# EAGLE design dil_oscillator (EAGLE 7.6.0)
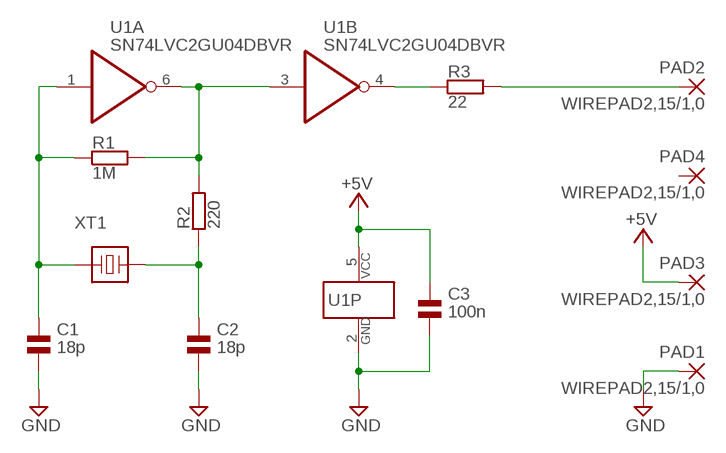
[diagram p0: schematic, sheet 1]

## Parts
C1  18p  CAP_NPOL-0603  [0603]
C2  18p  CAP_NPOL-0603  [0603]
C3  100n  CAP_NPOL-0603  [0603]
PAD1  WIREPAD2,15/1,0  [2,15/1,0]
PAD2  WIREPAD2,15/1,0  [2,15/1,0]
PAD3  WIREPAD2,15/1,0  [2,15/1,0]
PAD4  WIREPAD2,15/1,0  [2,15/1,0]
R1  1M  RES-SMD_0603  [0603]
R2  220  RES-SMD_0603  [0603]
R3  22  RES-SMD_0603  [0603]
U1  SN74LVC2GU04DBVR  74HC2GU04GV  [SOT457]
XT1  XTAL_3225  [3225_4PAD]

## Nets
+5V: C3.1 PAD3.1(P) U1.5(P:VCC)
GND: C1.2 C2.2 C3.2 PAD1.1(P) U1.2(P:GND)
N$1: C1.1 R1.1 U1.1(A:I) XT1.1
N$2: R1.2 R2.2 U1.3(B:I) U1.6(A:O)
N$3: C2.1 R2.1 XT1.3
N$4: R3.1 U1.4(B:O)
OUT: PAD2.1(P) R3.2
Unconnected: PAD4.1(P)

## Library data of the parts
C1-C3 = jc-passive:CAP_NPOL
PAD1-PAD4 = wirepad:WIREPAD: Wire PAD connect wire on PCB
R1-R3 = jc-passive:RES
U1 = jc-logic:74*2GU04: Dual unbuffered inverter
XT1 = jc-oscillators:XTAL_*

## Board
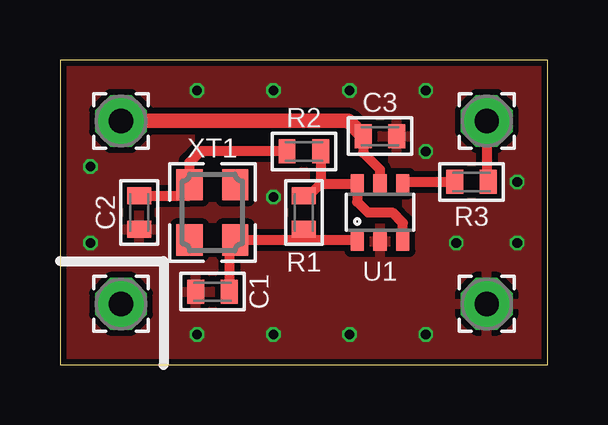
[diagram p1: board, top side]
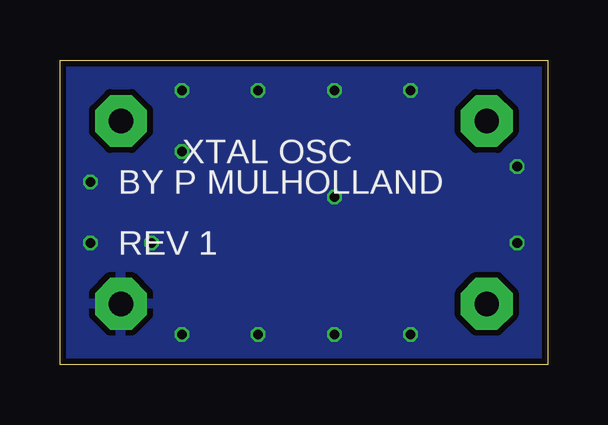
[diagram p2: board, bottom side, seen from below]

Size 20.32 x 12.7 mm. Coordinates in mm from the lower left corner, seen from the top.
Outline: 0,0 20.32,0 20.32,12.7 0,12.7 0,0
Copper layers (1*16): Top 0.035mm / dielectric 0.2mm / Bottom 0.035mm
Design rules "jlcpcb-2layers": minimum track width 3.5mil, minimum drill 0.2mm, track to track 5mil, track to pad 5mil, pad to pad 5mil, via to via 5mil, smd to smd 0mil, copper to edge 0.1mm, drill to drill 5mil, minimum pad ring 4mil, minimum via ring 4mil, stop-mask expansion 3mil, vias tented up to drill 100mil, thermal gap 10mil

### Footprints (pad centres in the part's own frame; a part is rotated, then mirrored left to right if it is on the bottom)
0603 = smd 0.7 x 1: 1 -0.7,0; 2 0.7,0
2,15/1,0 = drill 1.016 pad 2.159 octagon: 1 0,0
SOT457 = smd 0.55 x 0.8: 1 -0.95,-1.2; 2 0,-1.2; 3 0.95,-1.2; 4 0.95,1.2; 5 0,1.2; 6 -0.95,1.2
3225_4PAD = smd 1.3 x 1.1: 1 -1.15,-0.95; 2 1.15,-0.95; 3 1.15,0.95; 4 -1.15,0.95

### Placement (x,y rotation side)
C1  6.35,3.05 180 top
C2  3.3,6.35 270 top
C3  13.34,9.53 0 top
PAD1  17.78,2.54 0 top
PAD2  17.78,10.16 0 top
PAD3  2.54,10.16 0 top
PAD4  2.54,2.54 0 top
R1  10.16,6.35 90 top
R2  10.16,8.89 0 top
R3  17.14,7.62 0 top
U1  13.34,6.35 0 top
XT1  6.35,6.35 90 top

### Tracks (layer width: path | path; a pad name or v marks a point on that pad's centre or on a via)
+5V
  Top 0.406: U1.5 13.34,8.13 12.63,8.83 C3.1
  Top 0.61: PAD3.1 12,10.16 C3.1
GND  (via drill 0.4)
  other vias: 15.24,11.43 1.27,5.08 5.71,1.27 8.89,1.27 15.24,8.89 8.89,6.99 19.05,7.62 19.05,5.08 8.89,11.43 5.71,11.43 12.06,1.27 15.24,1.27 16.51,5.08 12.06,11.43 1.27,8.26
  pour Bottom (isolate 0.254): 0,12.7 20.32,12.7 20.32,0 0,0
  pour Top (isolate 0.254): 0,12.7 20.32,12.7 20.32,0 0,0
N$1
  Top 0.406: 10.16,5.2 XT1.1 7.05,5.2 C1.1 | R1.1 10.16,5.2 | U1.1 12.38,5.2 10.16,5.2
N$2
  Top 0.406: U1.3 14.29,5.91 13.84,6.35 12.83,6.35 12.38,6.79 U1.6 10.86,7.55 | R2.2 10.86,7.55 | R1.2 10.36,7.05 10.86,7.55
N$3
  Top 0.406: R2.1 5.84,8.89 5.4,8.45 XT1.3 5.4,7.05 C2.1
N$4
  Top 0.406: U1.4 14.29,7.62 R3.1
OUT
  Top 0.406: PAD2.1 17.78,7.62 R3.2

### Text on the board
bPlace: XTAL OSC | BY P MULHOLLAND | REV 1